# EAGLE design ReWireShield (EAGLE 6.5.0)
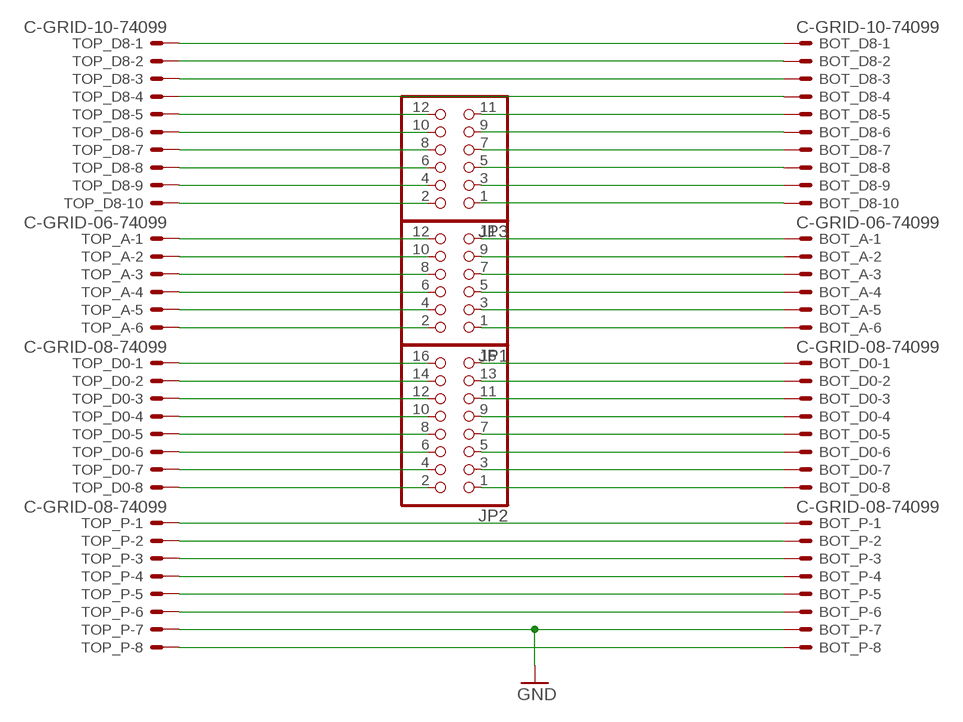
[diagram p0: schematic, sheet 1]

## Parts
BOT_A  C-GRID-06-74099  [74099-06]
BOT_D0  C-GRID-08-74099  [74099-08]
BOT_D8  C-GRID-10-74099  [74099-10]
BOT_P  C-GRID-08-74099  [74099-08]
JP1  PINHD-2X6/90  [2X06/90]
JP2  PINHD-2X8/90  [2X08/90]
JP3  PINHD-2X6/90  [2X06/90]
TOP_A  C-GRID-06-74099  [74099-06]
TOP_D0  C-GRID-08-74099  [74099-08]
TOP_D8  C-GRID-10-74099  [74099-10]
TOP_P  C-GRID-08-74099  [74099-08]

## Nets
GND: BOT_P.7 TOP_P.7
N$1: BOT_P.8 TOP_P.8
N$2: JP3.2 TOP_D8.10
N$3: BOT_P.6 TOP_P.6
N$4: JP3.4 TOP_D8.9
N$5: BOT_P.4 TOP_P.4
N$6: BOT_P.3 TOP_P.3
N$7: BOT_P.2 TOP_P.2
N$8: BOT_P.1 TOP_P.1
N$9: JP3.6 TOP_D8.8
N$10: JP3.8 TOP_D8.7
N$11: JP3.10 TOP_D8.6
N$12: JP3.12 TOP_D8.5
N$13: BOT_D8.10 JP3.1
N$14: BOT_D8.9 JP3.3
N$15: JP2.16 TOP_D0.1
N$16: JP2.14 TOP_D0.2
N$17: JP1.12 TOP_A.1
N$18: BOT_D8.8 JP3.5
N$19: BOT_D0.1 JP2.15
N$20: BOT_D0.2 JP2.13
N$21: BOT_D0.3 JP2.11
N$22: BOT_D0.4 JP2.9
N$23: BOT_D0.5 JP2.7
N$24: BOT_D0.6 JP2.5
N$25: BOT_D0.7 JP2.3
N$26: BOT_D0.8 JP2.1
N$27: BOT_A.1 JP1.11
N$28: BOT_A.2 JP1.9
N$29: BOT_A.3 JP1.7
N$30: BOT_A.4 JP1.5
N$31: BOT_A.5 JP1.3
N$32: BOT_A.6 JP1.1
N$33: JP2.12 TOP_D0.3
N$34: JP2.10 TOP_D0.4
N$35: JP2.8 TOP_D0.5
N$36: JP2.6 TOP_D0.6
N$37: JP2.4 TOP_D0.7
N$38: JP2.2 TOP_D0.8
N$39: JP1.10 TOP_A.2
N$40: JP1.8 TOP_A.3
N$41: JP1.6 TOP_A.4
N$42: JP1.4 TOP_A.5
N$43: JP1.2 TOP_A.6
N$44: BOT_D8.7 JP3.7
N$45: BOT_D8.6 JP3.9
N$46: BOT_D8.5 JP3.11
N$47: BOT_D8.4 TOP_D8.4
N$48: BOT_D8.3 TOP_D8.3
N$49: BOT_P.5 TOP_P.5
N$50: BOT_D8.2 TOP_D8.2
N$51: BOT_D8.1 TOP_D8.1

## Library data of the parts
BOT_A TOP_A = con-molex:C-GRID-06: CONNECTOR wire to board 2.54 mm (0.100") pitch header; OC_FARNELL: unknown; OC_NEWARK: unknown
BOT_D0 BOT_P TOP_D0 TOP_P = con-molex:C-GRID-08: CONNECTOR wire to board 2.54 mm (0.100") pitch header; OC_FARNELL: unknown; OC_NEWARK: unknown
BOT_D8 TOP_D8 = con-molex:C-GRID-10: CONNECTOR wire to board 2.54 mm (0.100") pitch header; OC_FARNELL: unknown; OC_NEWARK: unknown
JP1 JP3 = pinhead:PINHD-2X6: PIN HEADER
JP2 = pinhead:PINHD-2X8: PIN HEADER

## Net classes
0 default: width 0.254 mm

## Board
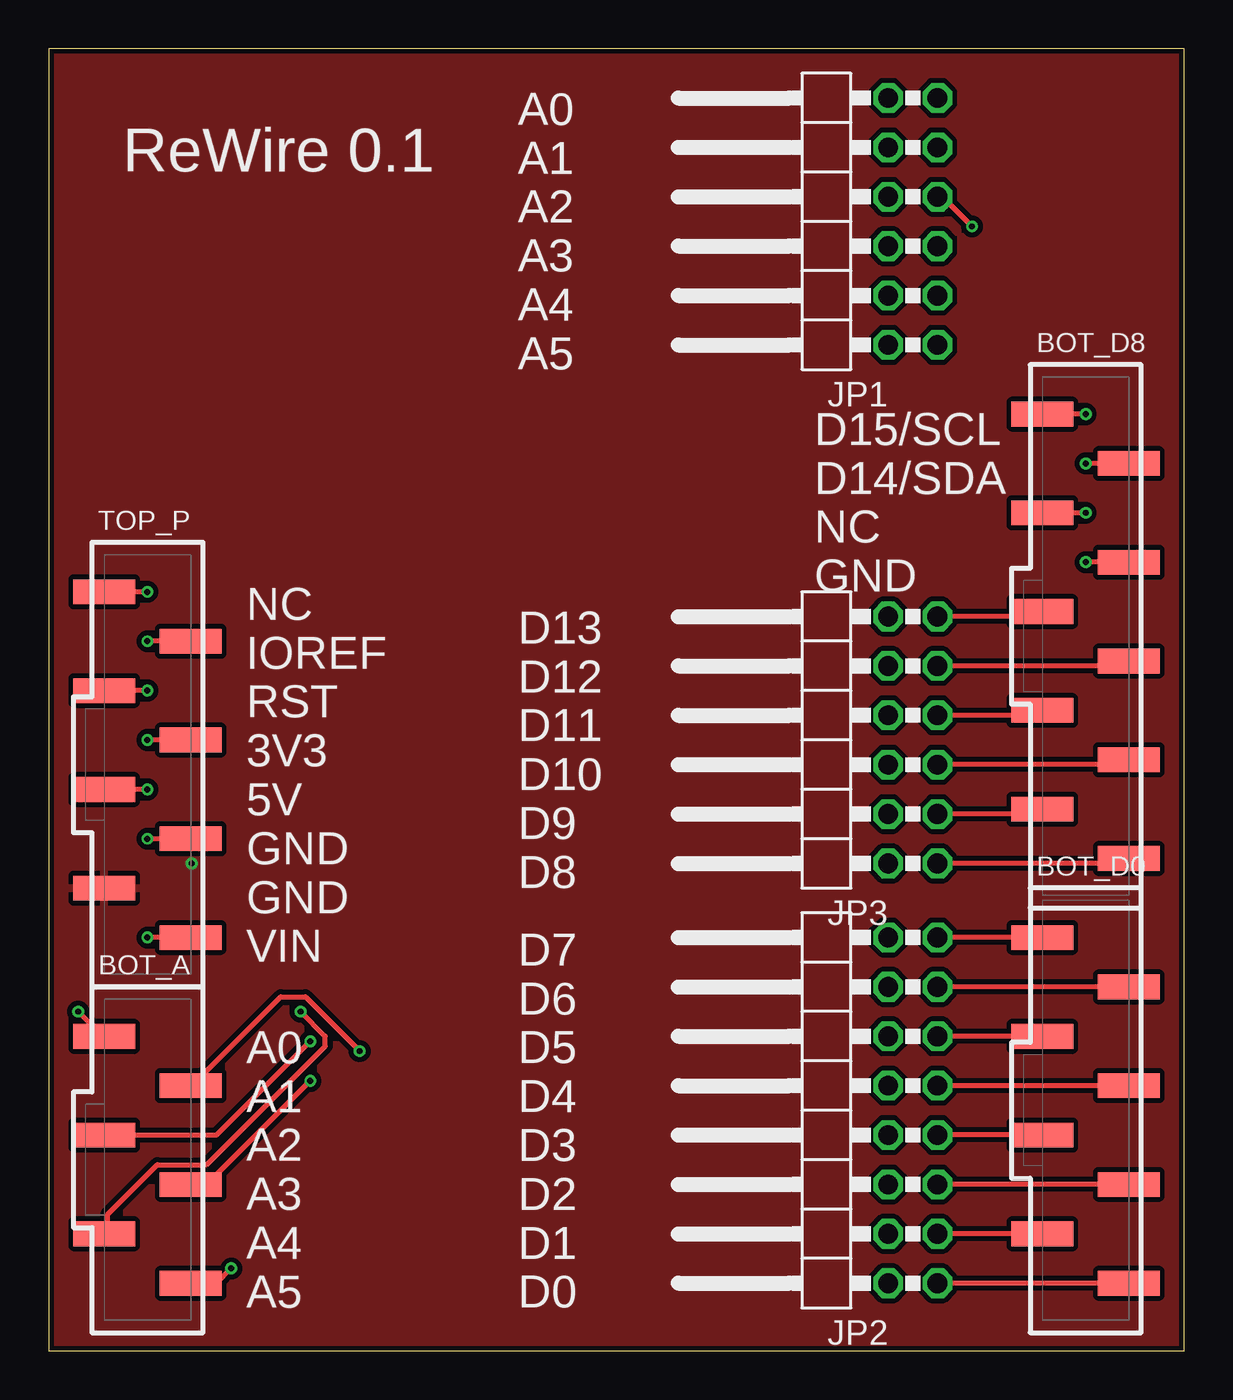
[diagram p1: board, top side]
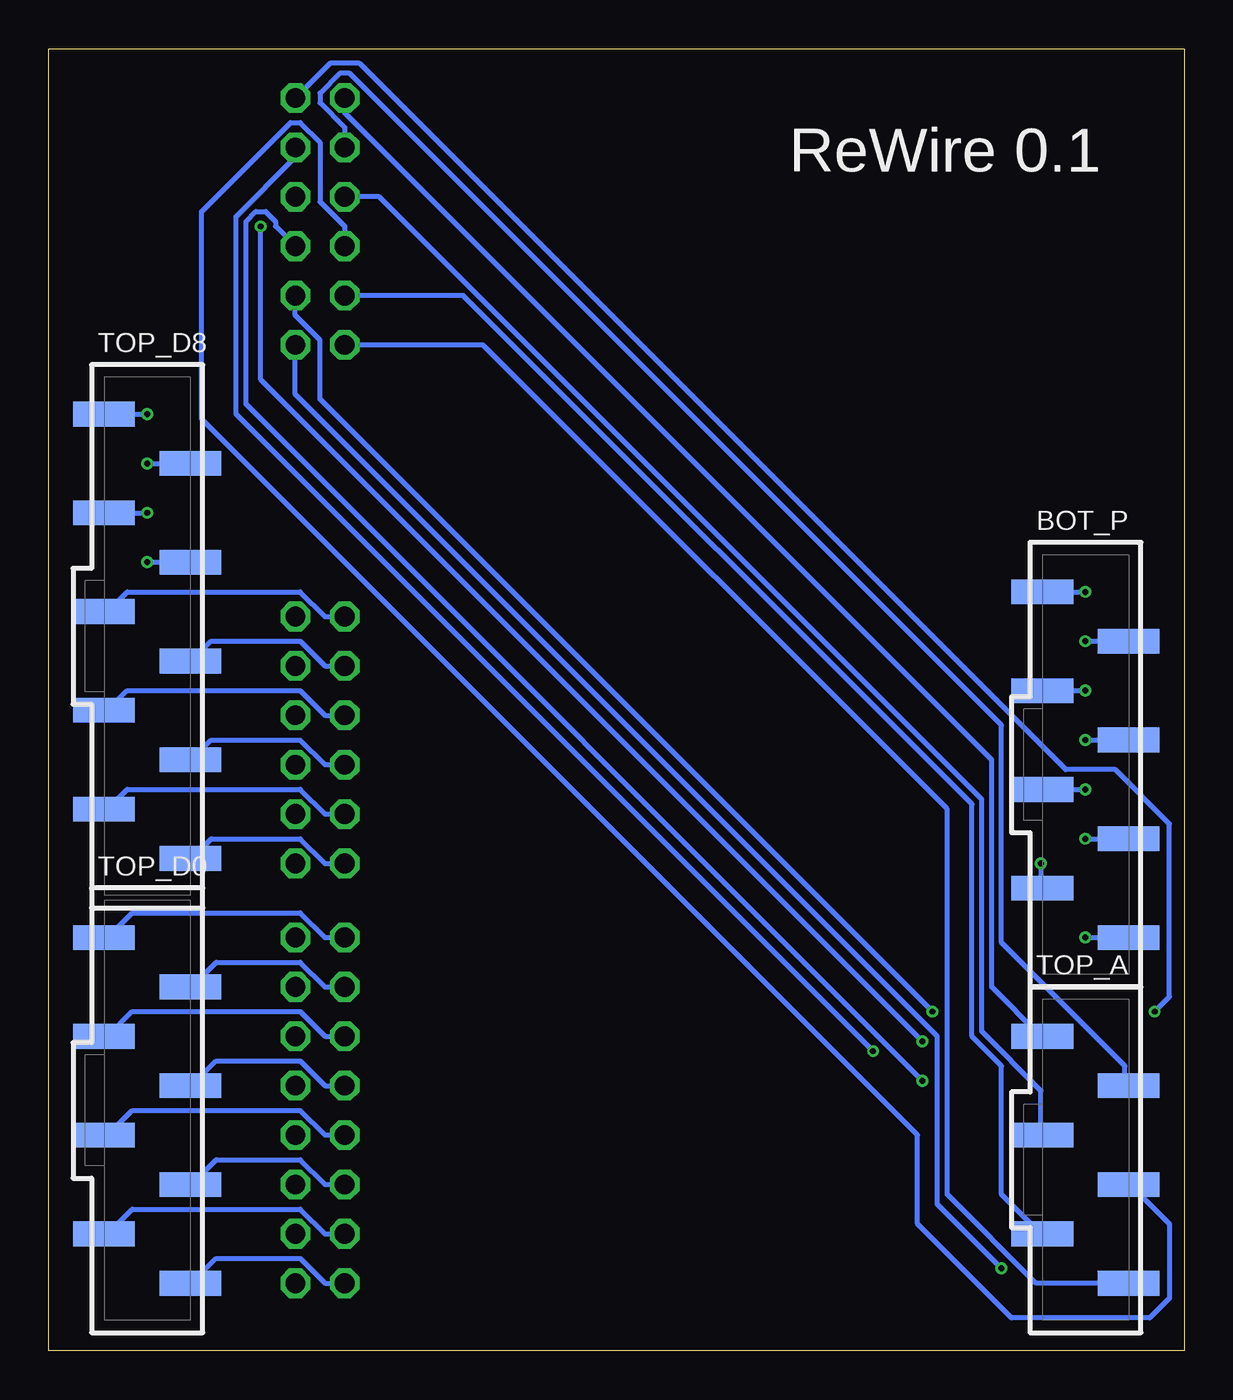
[diagram p2: board, bottom side, seen from below]

Size 58.41 x 66.98 mm. Coordinates in mm from the lower left corner, seen from the top.
Outline: 0,66.98 0,0 58.41,0 58.41,66.98 0,66.98
Copper layers (1*2*15*16): Top 0.035mm / dielectric 0.2mm / layer 2 0.0175mm / dielectric 1.1mm / layer 15 0.0175mm / dielectric 0.2mm / Bottom 0.035mm
Design rules "SeeedStudio_DRU_no_angle_20130527": minimum track width 6mil, minimum drill 12mil, track to track 6mil, track to pad 6mil, pad to pad 6mil, via to via 6mil, smd to smd 0mil, copper to edge 10mil, drill to drill 10mil, minimum pad ring 6mil, minimum via ring 6mil, stop-mask expansion 2mil, vias tented up to drill 25mil, thermal gap 10mil

### Footprints (pad centres in the part's own frame; a part is rotated, then mirrored left to right if it is on the bottom)
74099-06 = smd 1.27 x 3.175: 1 -6.35,-2.223; 2 -3.81,2.223; 3 -1.27,-2.223; 4 1.27,2.223; 5 3.81,-2.223; 6 6.35,2.223
74099-08 = smd 1.27 x 3.175: 1 -8.89,-2.223; 2 -6.35,2.223; 3 -3.81,-2.223; 4 -1.27,2.223; 5 1.27,-2.223; 6 3.81,2.223; 7 6.35,-2.223; 8 8.89,2.223
74099-10 = smd 1.27 x 3.175: 1 -11.43,-2.223; 2 -8.89,2.223; 3 -6.35,-2.223; 4 -3.81,2.223; 5 -1.27,-2.223; 6 1.27,2.223; 7 3.81,-2.223; 8 6.35,2.223; 9 8.89,-2.223; 10 11.43,2.223
2X06/90 = drill 1.016 octagon: 1 -6.35,-6.35; 2 -6.35,-3.81; 3 -3.81,-6.35; 4 -3.81,-3.81; 5 -1.27,-6.35; 6 -1.27,-3.81; 7 1.27,-6.35; 8 1.27,-3.81; 9 3.81,-6.35; 10 3.81,-3.81; 11 6.35,-6.35; 12 6.35,-3.81
2X08/90 = drill 1.016 octagon: 1 -8.89,-6.35; 2 -8.89,-3.81; 3 -6.35,-6.35; 4 -6.35,-3.81; 5 -3.81,-6.35; 6 -3.81,-3.81; 7 -1.27,-6.35; 8 -1.27,-3.81; 9 1.27,-6.35; 10 1.27,-3.81; 11 3.81,-6.35; 12 3.81,-3.81; 13 6.35,-6.35; 14 6.35,-3.81; 15 8.89,-6.35; 16 8.89,-3.81

### Placement (x,y rotation side)
BOT_A  5.08,9.83 270 top
BOT_D0  53.34,12.37 270 top
BOT_D8  53.34,36.75 270 top
BOT_P  5.08,30.15 270 bottom
JP1  39.37,58.09 90 top
JP2  39.37,12.37 90 top
JP3  39.37,31.42 90 top
TOP_A  5.08,9.83 270 bottom
TOP_D0  53.34,12.37 270 bottom
TOP_D8  53.34,36.75 270 bottom
TOP_P  5.08,30.15 270 top

### Tracks (layer width: path | path; a pad name or v marks a point on that pad's centre or on a via)
GND  (via drill 0.3)
  Bottom 0.254: v7.37,25.07 7.37,23.8 BOT_P.7
  pour Top (isolate 0.254): 58.42,66.98 58.42,-0.33 0,-0.33 0,66.98
N$1  (via drill 0.3)
  Top 0.254: TOP_P.8 v5.08,21.26
  Bottom 0.254: v5.08,21.26 BOT_P.8
N$2
  Bottom 0.254: JP3.2 44.2,25.07 45.47,26.34 50.04,26.34 51.05,25.32 TOP_D8.10
N$3  (via drill 0.3)
  Top 0.254: TOP_P.6 v5.08,26.34
  Bottom 0.254: v5.08,26.34 BOT_P.6
N$4
  Bottom 0.254: JP3.4 44.2,27.61 45.47,28.88 54.36,28.88 55.37,27.86 TOP_D8.9
N$5  (via drill 0.3)
  Top 0.254: TOP_P.4 v5.08,31.42
  Bottom 0.254: v5.08,31.42 BOT_P.4
N$6  (via drill 0.3)
  Top 0.254: v5.08,33.96 TOP_P.3
  Bottom 0.254: BOT_P.3 v5.08,33.96
N$7  (via drill 0.3)
  Top 0.254: TOP_P.2 v5.08,36.5
  Bottom 0.254: v5.08,36.5 BOT_P.2
N$8  (via drill 0.3)
  Top 0.254: v5.08,39.04 TOP_P.1
  Bottom 0.254: BOT_P.1 v5.08,39.04
N$9
  Bottom 0.254: JP3.6 44.2,30.15 45.47,31.42 50.04,31.42 51.05,30.4 TOP_D8.8
N$10
  Bottom 0.254: JP3.8 44.2,32.69 45.47,33.96 54.36,33.96 55.37,32.94 TOP_D8.7
N$11
  Bottom 0.254: JP3.10 44.2,35.23 45.47,36.5 50.04,36.5 51.05,35.48 TOP_D8.6
N$12
  Bottom 0.254: JP3.12 44.2,37.77 45.47,39.04 54.36,39.04 55.37,38.02 TOP_D8.5
N$13
  Top 0.254: JP3.1 55.12,25.07 55.37,25.32 BOT_D8.10
N$14
  Top 0.254: JP3.3 50.8,27.61 51.05,27.86 BOT_D8.9
N$15
  Bottom 0.254: JP2.16 44.2,21.26 45.47,22.53 54.1,22.53 55.37,21.26 TOP_D0.1
N$16
  Bottom 0.254: JP2.14 44.2,18.72 45.47,19.99 49.78,19.99 51.05,18.72 TOP_D0.2
N$17
  Bottom 0.254: JP1.12 43.18,63.68 9.91,30.4 9.91,18.72 7.37,16.18 TOP_A.1
N$18
  Top 0.254: JP3.5 55.12,30.15 55.37,30.4 BOT_D8.8
N$19
  Top 0.254: BOT_D0.1 JP2.15
N$20
  Top 0.254: BOT_D0.2 JP2.13
N$21
  Top 0.254: BOT_D0.3 JP2.11
N$22
  Top 0.254: BOT_D0.4 JP2.9
N$23
  Top 0.254: BOT_D0.5 JP2.7
N$24
  Top 0.254: BOT_D0.6 JP2.5
N$25
  Top 0.254: BOT_D0.7 JP2.3
N$26
  Top 0.254: BOT_D0.8 JP2.1
N$27  (via drill 0.3)
  Top 0.254: v1.52,17.45 2.79,16.18 BOT_A.1
  Bottom 0.254: JP1.11 43.94,66.22 42.42,66.22 6.1,29.9 3.56,29.9 0.76,27.1 0.76,18.21 v1.52,17.45
N$28  (via drill 0.3)
  Top 0.254: v16,15.42 13.21,18.21 11.94,18.21 7.37,13.64 BOT_A.2
  Bottom 0.254: JP1.9 45.72,61.39 48.77,58.34 48.77,48.18 v16,15.42
N$29  (via drill 0.3)
  Top 0.254: JP1.7 45.97,59.36 v47.5,57.84 | v13.46,15.93 8.64,11.1 BOT_A.3
  Bottom 0.254: v47.5,57.84 47.5,49.96 v13.46,15.93
N$30  (via drill 0.3)
  Top 0.254: v13.46,13.89 8.13,8.56 BOT_A.4
  Bottom 0.254: JP1.5 46.74,57.84 46.74,58.09 47.24,58.6 47.75,58.6 48.26,58.09 48.26,48.69 v13.46,13.89
N$31  (via drill 0.3)
  Top 0.254: v12.95,17.45 14.22,16.18 14.22,15.67 8.13,9.58 5.59,9.58 3.05,7.04 3.05,6.02 BOT_A.5
  Bottom 0.254: JP1.3 45.72,53.26 44.45,51.99 44.45,48.95 v12.95,17.45
N$32  (via drill 0.3)
  Top 0.254: v9.4,4.24 8.64,3.48 BOT_A.6
  Bottom 0.254: JP1.1 45.72,49.2 12.7,16.18 12.7,7.54 v9.4,4.24
N$33
  Bottom 0.254: JP2.12 44.2,16.18 45.47,17.45 54.1,17.45 55.37,16.18 TOP_D0.3
N$34
  Bottom 0.254: JP2.10 44.2,13.64 45.47,14.91 49.78,14.91 51.05,13.64 TOP_D0.4
N$35
  Bottom 0.254: JP2.8 44.2,11.1 45.47,12.37 54.1,12.37 55.37,11.1 TOP_D0.5
N$36
  Bottom 0.254: JP2.6 44.2,8.56 45.47,9.83 49.78,9.83 51.05,8.56 TOP_D0.6
N$37
  Bottom 0.254: JP2.4 44.2,6.02 45.47,7.29 54.1,7.29 55.37,6.02 TOP_D0.7
N$38
  Bottom 0.254: JP2.2 44.2,3.48 45.47,4.75 49.78,4.75 51.05,3.48 TOP_D0.8
N$39
  Bottom 0.254: JP1.10 43.18,62.92 44.45,64.19 44.45,64.69 43.43,65.71 42.93,65.71 9.4,32.18 9.4,21.01 3.05,14.66 3.05,13.64 TOP_A.2
N$40
  Bottom 0.254: JP1.8 41.4,59.36 10.41,28.37 10.41,16.43 7.37,13.39 7.37,11.1 TOP_A.3
N$41
  Bottom 0.254: JP1.6 43.18,57.84 44.45,59.11 44.45,62.15 45.47,63.17 45.97,63.17 50.55,58.6 50.55,47.93 13.72,11.1 13.72,6.53 8.89,1.7 1.78,1.7 0.76,2.72 0.76,6.53 2.79,8.56 TOP_A.4
N$42
  Bottom 0.254: JP1.4 37.08,54.28 10.92,28.12 10.92,16.18 9.4,14.66 9.4,8.05 7.37,6.02 TOP_A.5
N$43
  Bottom 0.254: JP1.2 36.07,51.74 12.19,27.86 12.19,8.05 7.62,3.48 TOP_A.6
N$44
  Top 0.254: JP3.7 50.8,32.69 51.05,32.94 BOT_D8.7
N$45
  Top 0.254: JP3.9 55.12,35.23 55.37,35.48 BOT_D8.6
N$46
  Top 0.254: JP3.11 50.8,37.77 51.05,38.02 BOT_D8.5
N$47  (via drill 0.3)
  Top 0.254: BOT_D8.4 v53.34,40.56
  Bottom 0.254: v53.34,40.56 TOP_D8.4
N$48  (via drill 0.3)
  Top 0.254: v53.34,43.1 BOT_D8.3
  Bottom 0.254: TOP_D8.3 v53.34,43.1
N$49  (via drill 0.3)
  Top 0.254: v5.08,28.88 TOP_P.5
  Bottom 0.254: BOT_P.5 v5.08,28.88
N$50  (via drill 0.3)
  Top 0.254: BOT_D8.2 v53.34,45.64
  Bottom 0.254: v53.34,45.64 TOP_D8.2
N$51  (via drill 0.3)
  Top 0.254: v53.34,48.18 BOT_D8.1
  Bottom 0.254: TOP_D8.1 v53.34,48.18

### Text on the board
tNames: ReWire 0.1 | A0 / A1 / A2 / A3 / A4 / A5 | D15/SCL / D14/SDA / NC / GND | D13 / D12 / D11 / D10 / D9 / D8 | NC / IOREF / RST / 3V3 / 5V / GND / GND / VIN | A0 / A1 / A2 / A3 / A4 / A5 | D7 / D6 / D5 / D4 / D3 / D2 / D1 / D0
bNames: ReWire 0.1